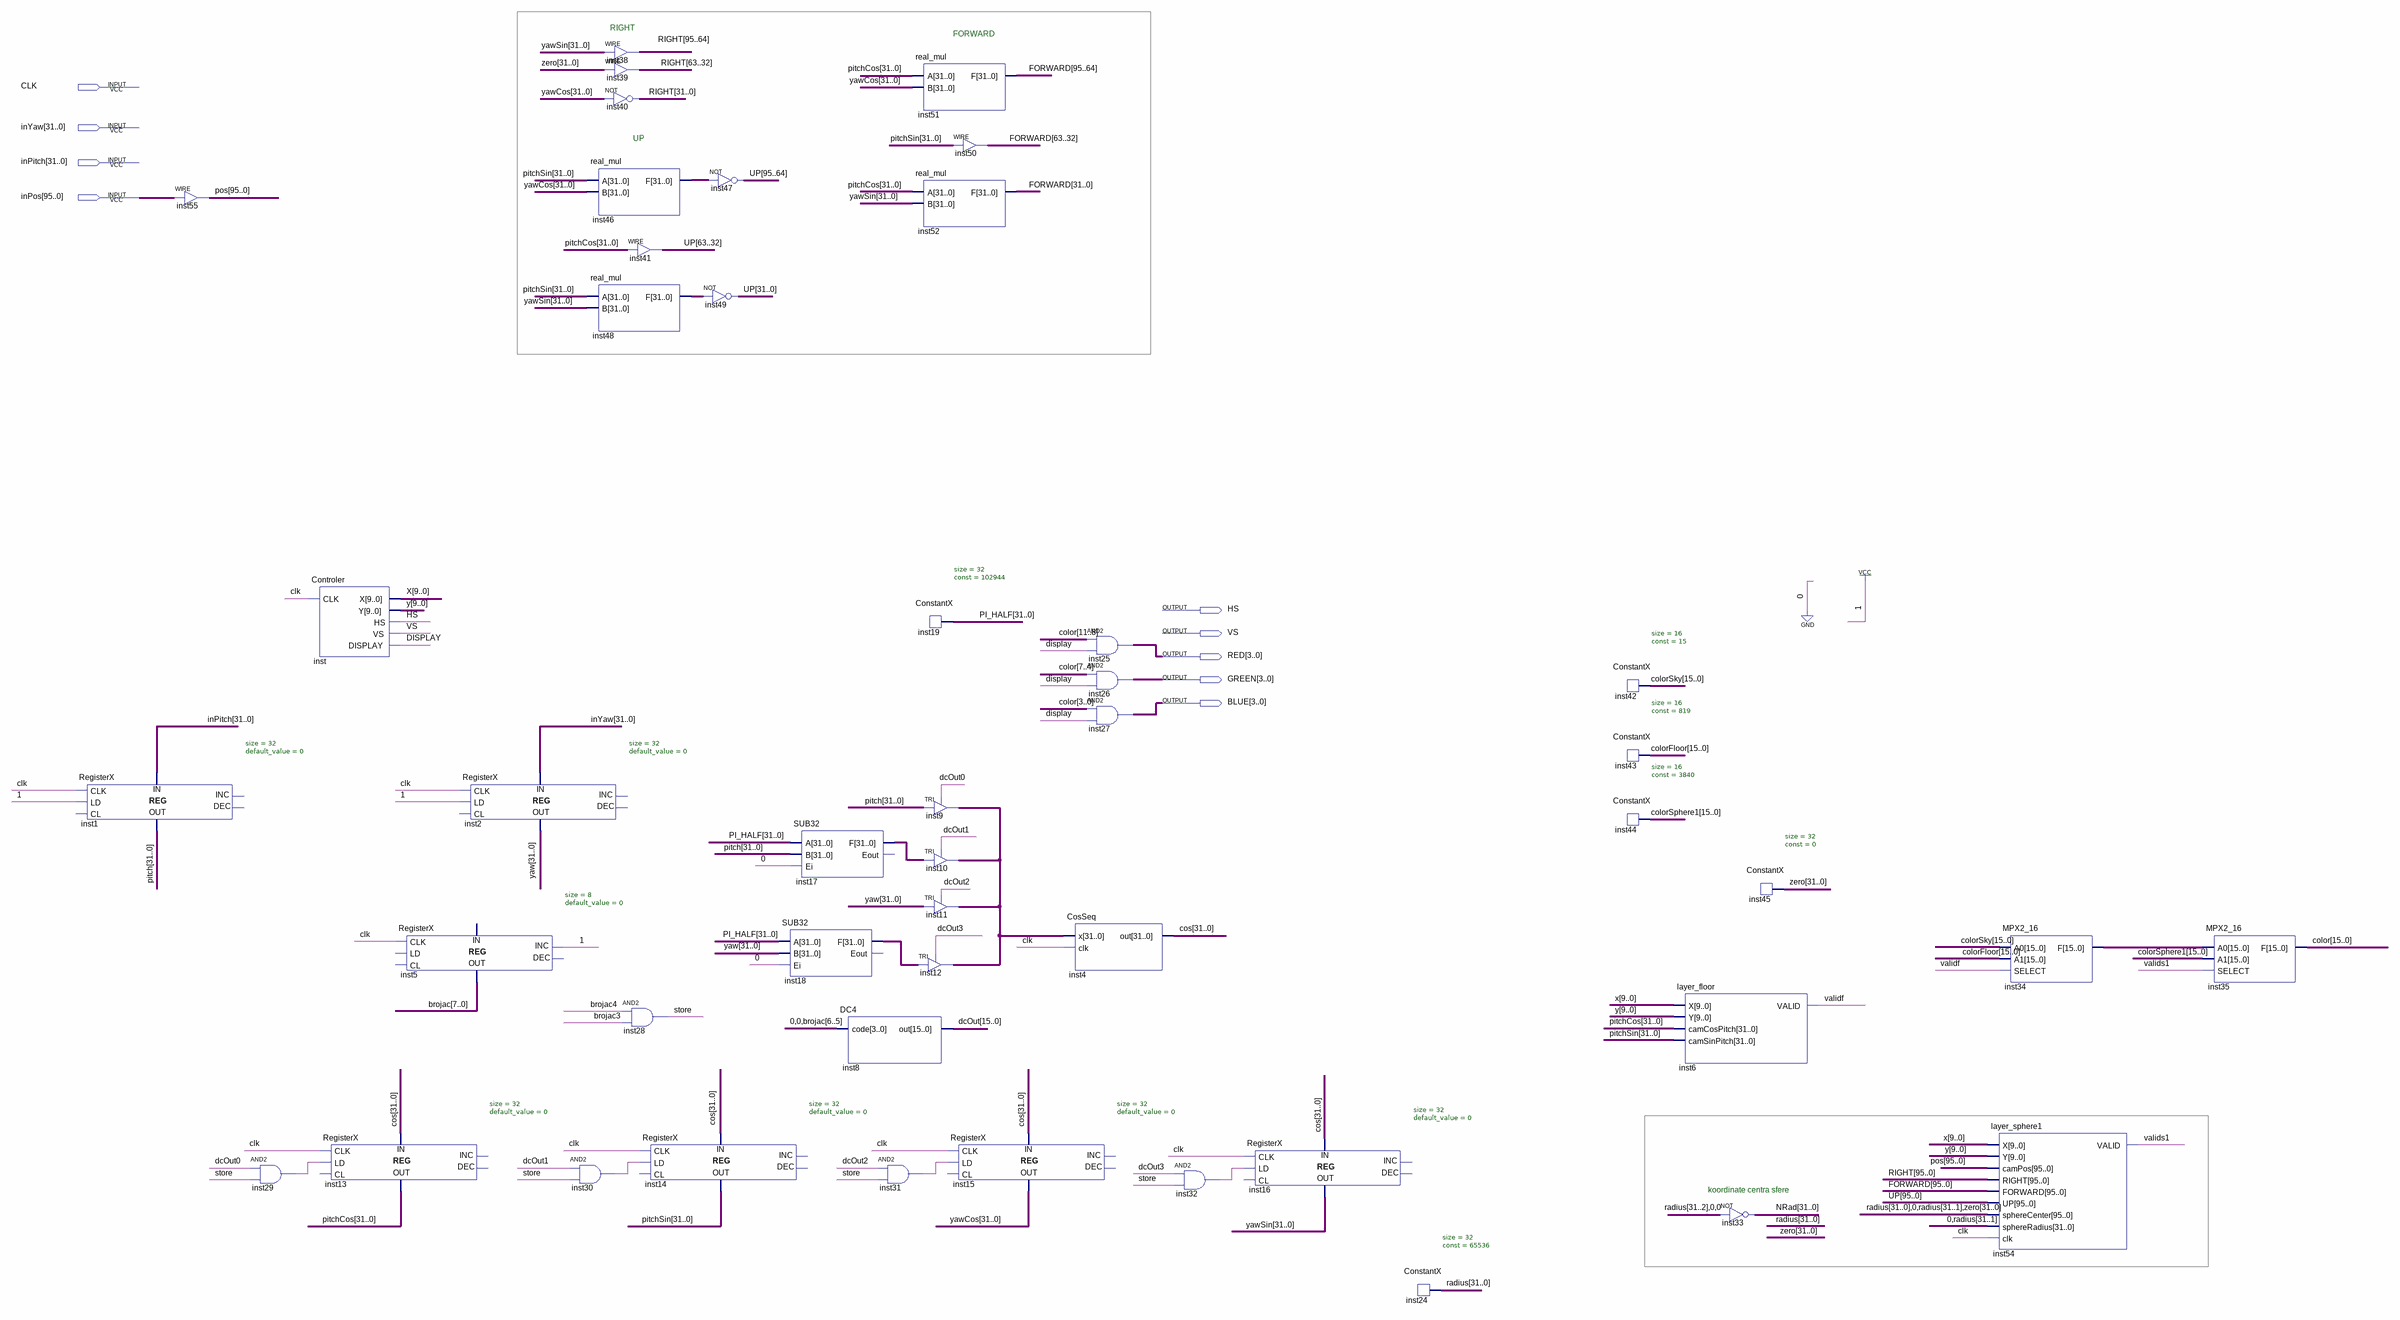
[diagram p0: schematic sheet]
// Quartus schematic GPU.bdf as structural Verilog: 47 symbols, 9 pins
module GPU (
  input  CLK,
  input  [31:0] inYaw,
  input  [31:0] inPitch,
  input  [95:0] inPos,
  output HS,
  output VS,
  output [3:0] RED,
  output [3:0] GREEN,
  output [3:0] BLUE
);

  wire DISPLAY, inst29_out, inst30_out, inst31_out, inst32_out, store, validf, valids1;
  wire [7:0] brojac;
  wire [9:0] X, y;
  wire [15:0] color, colorFloor, colorSky, colorSphere1, dcOut, inst34_f;
  wire [31:0] cos, inst9_out, inst17_f, inst18_f, inst46_f, inst48_f, NRad, PI_HALF, pitch, pitchCos,
       pitchSin, radius, yaw, yawCos, yawSin, zero;
  wire [95:0] FORWARD, pos, RIGHT, UP;

  RegisterX #(.size(32), .default_value(0)) inst1 (
    .CLK(CLK), .LD(1'b1), .DATA_IN(inPitch), .DATA_OUT(pitch));  // open: CL, INC, DEC
  assign pos = inPos;  // WIRE inst55
  and inst29 (inst29_out, dcOut[0], store);
  Controler inst (.CLK(CLK), .X(X), .Y(y), .HS(HS), .VS(VS), .DISPLAY(DISPLAY));
  RegisterX #(.size(32), .default_value(0)) inst13 (
    .CLK(CLK), .LD(inst29_out), .DATA_IN(cos), .DATA_OUT(pitchCos));  // open: CL, INC, DEC
  RegisterX #(.size(8), .default_value(0)) inst5 (
    .CLK(CLK), .INC(1'b1), .DATA_OUT(brojac));  // open: LD, CL, DEC, DATA_IN
  RegisterX #(.size(32), .default_value(0)) inst2 (
    .CLK(CLK), .LD(1'b1), .DATA_IN(inYaw), .DATA_OUT(yaw));  // open: CL, INC, DEC
  and inst30 (inst30_out, dcOut[1], store);
  assign RIGHT[95:64] = yawSin;  // WIRE inst38
  assign RIGHT[63:32] = zero;  // WIRE inst39
  assign RIGHT[31:0] = ~yawCos;  // NOT inst40, 32 bits wide
  real_mul inst46 (.A(pitchSin), .B(yawCos), .F(inst46_f));
  assign UP[63:32] = pitchCos;  // WIRE inst41
  real_mul inst48 (.A(pitchSin), .B(yawSin), .F(inst48_f));
  and inst28 (store, brojac[4], brojac[3]);
  RegisterX #(.size(32), .default_value(0)) inst14 (
    .CLK(CLK), .LD(inst30_out), .DATA_IN(cos), .DATA_OUT(pitchSin));  // open: CL, INC, DEC
  assign UP[95:64] = ~inst46_f;  // NOT inst47, 32 bits wide
  assign UP[31:0] = ~inst48_f;  // NOT inst49, 32 bits wide
  SUB32 inst17 (.A(PI_HALF), .B(pitch), .Ei(1'b0), .F(inst17_f));  // open: Eout
  SUB32 inst18 (.A(PI_HALF), .B(yaw), .Ei(1'b0), .F(inst18_f));  // open: Eout
  DC4 inst8 (.code({2'b00, brojac[6:5]}), .out(dcOut));
  and inst31 (inst31_out, dcOut[2], store);
  real_mul inst51 (.A(pitchCos), .B(yawCos), .F(FORWARD[95:64]));
  assign FORWARD[63:32] = pitchSin;  // WIRE inst50
  real_mul inst52 (.A(pitchCos), .B(yawSin), .F(FORWARD[31:0]));
  ConstantX #(.size(32), .\const (102944)) inst19 (.DATA_OUT(PI_HALF));
  TRI inst9[31:0] (.IN(pitch), .OE(dcOut[0]), .OUT(inst9_out));
  TRI inst10[31:0] (.IN(inst17_f), .OE(dcOut[1]), .OUT(inst9_out));
  TRI inst11[31:0] (.IN(yaw), .OE(dcOut[2]), .OUT(inst9_out));
  TRI inst12[31:0] (.IN(inst18_f), .OE(dcOut[3]), .OUT(inst9_out));
  RegisterX #(.size(32), .default_value(0)) inst15 (
    .CLK(CLK), .LD(inst31_out), .DATA_IN(cos), .DATA_OUT(yawCos));  // open: CL, INC, DEC
  assign RED = color[11:8] & {4{DISPLAY}};  // AND2 inst25, 4 bits wide
  assign GREEN = color[7:4] & {4{DISPLAY}};  // AND2 inst26, 4 bits wide
  assign BLUE = color[3:0] & {4{DISPLAY}};  // AND2 inst27, 4 bits wide
  CosSeq inst4 (.x(inst9_out), .clk(CLK), .out(cos));
  and inst32 (inst32_out, dcOut[3], store);
  RegisterX #(.size(32), .default_value(0)) inst16 (
    .CLK(CLK), .LD(inst32_out), .DATA_IN(cos), .DATA_OUT(yawSin));  // open: CL, INC, DEC
  ConstantX #(.size(32), .\const (65536)) inst24 (.DATA_OUT(radius));
  ConstantX #(.size(16), .\const (15)) inst42 (.DATA_OUT(colorSky));
  ConstantX #(.size(16), .\const (819)) inst43 (.DATA_OUT(colorFloor));
  ConstantX #(.size(16), .\const (3840)) inst44 (.DATA_OUT(colorSphere1));
  layer_floor inst6 (.X(X), .Y(y), .camCosPitch(pitchCos), .camSinPitch(pitchSin), .VALID(validf));
  ConstantX #(.size(32), .\const (0)) inst45 (.DATA_OUT(zero));
  assign NRad = ~{radius[31:2], 2'b00};  // NOT inst33, 32 bits wide
  MPX2_16 inst34 (.A0(colorSky), .A1(colorFloor), .SELECT(validf), .F(inst34_f));
  layer_sphere1 inst54 (
    .X(X), .Y(y), .camPos(pos), .RIGHT(RIGHT), .FORWARD(FORWARD), .UP(UP),
    .sphereCenter({radius, 1'b0, radius[31:1], zero}), .sphereRadius({1'b0, radius[31:1]}), .clk(CLK),
    .VALID(valids1));
  MPX2_16 inst35 (.A0(inst34_f), .A1(colorSphere1), .SELECT(valids1), .F(color));

  // Notes on the sheet:
  //   RIGHT
  //   FORWARD
  //   UP
  //   koordinate centra sfere
endmodule
